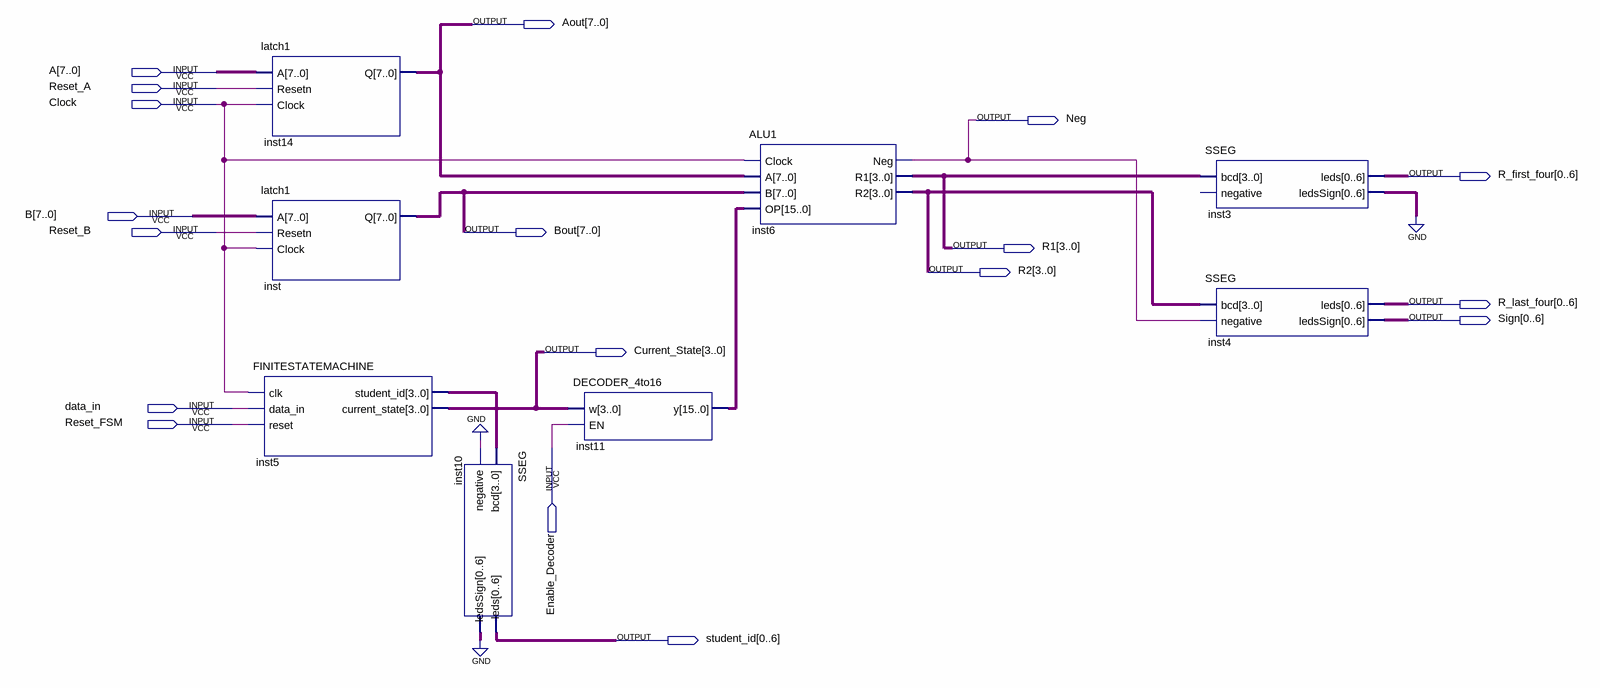
[diagram p0: schematic sheet]
// Quartus schematic PROBLEMSET1.bdf as structural Verilog: 8 symbols, 18 pins
module PROBLEMSET1 (
  input  [7:0] A,
  input  Reset_A,
  input  Clock,
  input  [7:0] B,
  input  Reset_B,
  input  data_in,
  input  Reset_FSM,
  input  Enable_Decoder,
  output [7:0] Aout,
  output Neg,
  output [0:6] R_first_four,
  output [7:0] Bout,
  output [3:0] R1,
  output [3:0] R2,
  output [0:6] R_last_four,
  output [0:6] Sign,
  output [3:0] Current_State,
  output [0:6] student_id
);

  wire [3:0] inst5_student_id;
  wire [6:0] inst3_ledssign, inst10_ledssign;
  wire [15:0] inst11_y;

  latch1 inst14 (.A(A), .Resetn(Reset_A), .Clock(Clock), .Q(Aout));
  latch1 inst (.A(B), .Resetn(Reset_B), .Clock(Clock), .Q(Bout));
  FINITESTATEMACHINE inst5 (
    .clk(Clock), .data_in(data_in), .reset(Reset_FSM), .student_id(inst5_student_id),
    .current_state(Current_State));
  SSEG inst10 (.bcd(inst5_student_id), .negative(1'b0), .leds(student_id), .ledsSign(inst10_ledssign));
  DECODER_4to16 inst11 (.w(Current_State), .EN(Enable_Decoder), .y(inst11_y));
  ALU1 inst6 (.Clock(Clock), .A(Aout), .B(Bout), .OP(inst11_y), .Neg(Neg), .R1(R1), .R2(R2));
  SSEG inst3 (.bcd(R1), .leds(R_first_four), .ledsSign(inst3_ledssign));  // open: negative
  SSEG inst4 (.bcd(R2), .negative(Neg), .leds(R_last_four), .ledsSign(Sign));
  // also tied to GND on the sheet: {inst10_ledssign[0], inst10_ledssign[1], inst10_ledssign[2], inst10_ledssign[3], inst10_ledssign[4], inst10_ledssign[5], inst10_ledssign[6], inst3_ledssign[0], inst3_ledssign[1], inst3_ledssign[2], inst3_ledssign[3], inst3_ledssign[4], inst3_ledssign[5], inst3_ledssign[6]}
endmodule
